# Altium schematic sheet SOM_JB2.SchDoc: SoM TE0720 JB2
size 420 x 297 mm; Author: P. Zdunek; DrawnBy: P. Zdunek; Organization: Altium Limited; Address1: L3, 12a Rodborough Rd; Address2: Frenchs Forest; Address3: NSW; Address4: Australia 2086; DocumentNumber: 4; SheetNumber: 4; SheetTotal: 37; ModifiedBy: -; CheckedDate: -; Title2: Fast Stabilizer; DivGrp: WUT ISE; Designer: G.Kasprowicz
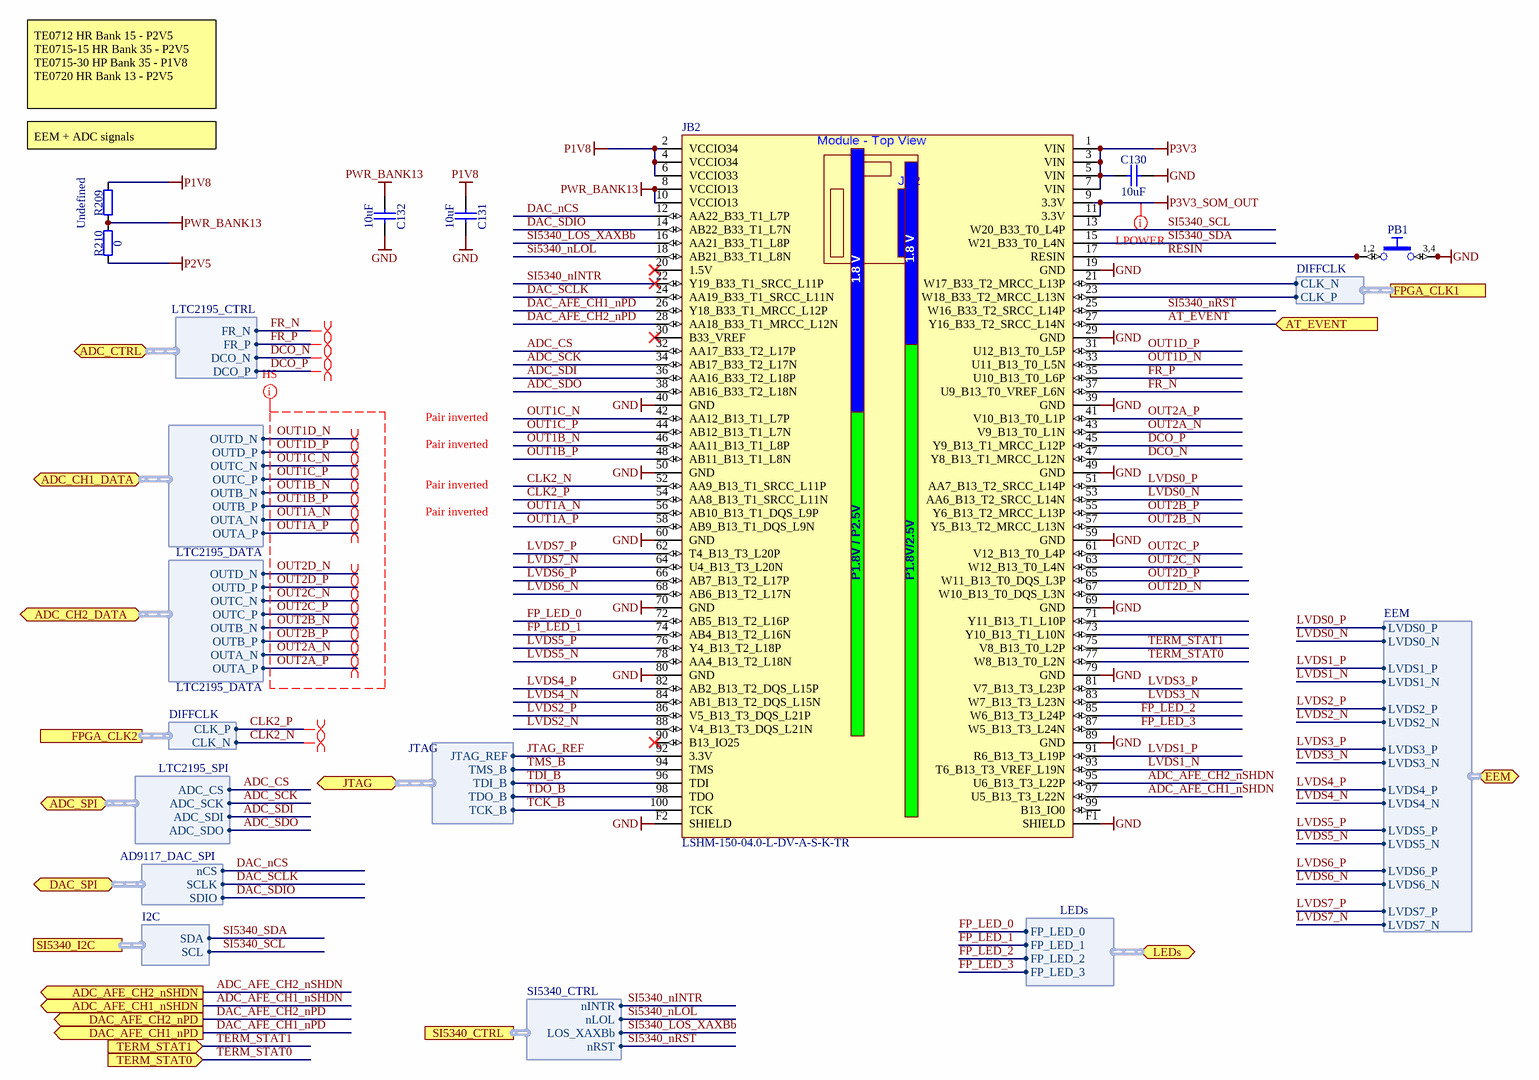
[diagram p0: SOM_JB2.SchDoc]

## Parts
C130  10uF  [CAPC1608X80N]
C131  10uF  [CAPC1608X80N]
C132  10uF  [CAPC1608X80N]
JB2  LSHM-150-04.0-L-DV-A-S-K-TR  [LSHM-150-XXX-X-DV-A-X]
PB1  Push Button  [PB_TYCO_FSM6JSMA]  (value not drawn)
R209  Undefined  [RESC1608X55N]
R210  0  [RESC1005X40N]

## Ports
ADC_AFE_CH1_nSHDN (out), ADC_AFE_CH2_nSHDN (out), ADC_CH1_DATA (bidir, harness LTC2195_DATA), ADC_CH2_DATA (bidir, harness LTC2195_DATA), ADC_CTRL (bidir, harness LTC2195_CTRL), ADC_SPI (bidir, harness LTC2195_SPI), AT_EVENT (in), DAC_AFE_CH1_nPD (out), DAC_AFE_CH2_nPD (out), DAC_SPI (bidir, harness AD9117_DAC_SPI), EEM (bidir, harness EEM), FPGA_CLK1 (harness DIFFCLK), FPGA_CLK2 (harness DIFFCLK), JTAG (bidir, harness JTAG), LEDs (bidir, harness LEDs), SI5340_CTRL (harness SI5340_CTRL), SI5340_I2C (harness I2C), TERM_STAT0 (in), TERM_STAT1 (in)

## Harnesses
JTAG: JTAG_REF, TDO_B, TMS_B, TDI_B, TCK_B
EEM: LVDS0_P, LVDS0_N, LVDS1_P, LVDS1_N, LVDS2_P, LVDS2_N, LVDS3_P, LVDS3_N, LVDS4_P, LVDS4_N, LVDS5_P, LVDS5_N, LVDS6_P, LVDS6_N, LVDS7_P, LVDS7_N
LTC2195_DATA: OUTD_N, OUTD_P, OUTC_N, OUTC_P, OUTB_N, OUTB_P, OUTA_N, OUTA_P
LTC2195_CTRL: FR_N, FR_P, DCO_N, DCO_P
DIFFCLK: CLK_P, CLK_N
LTC2195_SPI: ADC_CS, ADC_SCK, ADC_SDI, ADC_SDO
AD9117_DAC_SPI: SCLK, nCS, SDIO
I2C: SDA, SCL
SI5340_CTRL: nINTR, nLOL, LOS_XAXBb, nRST
LEDs: FP_LED_0, FP_LED_1, FP_LED_2, FP_LED_3

## Nets
GND: C130.2 C131.2 C132.2 JB2.19(GND) JB2.29(GND) JB2.39(GND) JB2.40(GND) JB2.49(GND) JB2.50(GND) JB2.59(GND) JB2.60(GND) JB2.69(GND) JB2.70(GND) JB2.79(GND) JB2.80(GND) JB2.89(GND) JB2.F1(SHIELD) JB2.F2(SHIELD) PB1.3 PB1.4
P1V8: C131.1 JB2.2(VCCIO34) JB2.4(VCCIO34) JB2.6(VCCIO33) R209.2
P2V5: R210.1
P3V3: C130.1 JB2.1(VIN) JB2.3(VIN) JB2.5(VIN) JB2.7(VIN)
P3V3_SOM_OUT: JB2.9(3.3V) JB2.11(3.3V)
PWR_BANK13: C132.1 JB2.8(VCCIO13) JB2.10(VCCIO13) R209.1 R210.2
ADC_AFE_CH1_nSHDN: JB2.97(U5_B13_T3_L22N) ; port ADC_AFE_CH1_nSHDN
ADC_AFE_CH2_nSHDN: JB2.95(U6_B13_T3_L22P) ; port ADC_AFE_CH2_nSHDN
ADC_CS: JB2.32(AA17_B33_T2_L17P) ; port ADC_SPI.ADC_CS
ADC_SCK: JB2.34(AB17_B33_T2_L17N) ; port ADC_SPI.ADC_SCK
ADC_SDI: JB2.36(AA16_B33_T2_L18P) ; port ADC_SPI.ADC_SDI
ADC_SDO: JB2.38(AB16_B33_T2_L18N) ; port ADC_SPI.ADC_SDO
AT_EVENT: JB2.27(Y16_B33_T2_SRCC_L14N) ; port AT_EVENT
CLK2_N: JB2.52(AA9_B13_T1_SRCC_L11P) ; port FPGA_CLK2.CLK_N
CLK2_P: JB2.54(AA8_B13_T1_SRCC_L11N) ; port FPGA_CLK2.CLK_P
DAC_AFE_CH1_nPD: JB2.26(Y18_B33_T1_MRCC_L12P) ; port DAC_AFE_CH1_nPD
DAC_AFE_CH2_nPD: JB2.28(AA18_B33_T1_MRCC_L12N) ; port DAC_AFE_CH2_nPD
DAC_nCS: JB2.12(AA22_B33_T1_L7P) ; port DAC_SPI.nCS
DAC_SCLK: JB2.24(AA19_B33_T1_SRCC_L11N) ; port DAC_SPI.SCLK
DAC_SDIO: JB2.14(AB22_B33_T1_L7N) ; port DAC_SPI.SDIO
DCO_N: JB2.47(Y8_B13_T1_MRCC_L12N) ; port ADC_CTRL.DCO_N
DCO_P: JB2.45(Y9_B13_T1_MRCC_L12P) ; port ADC_CTRL.DCO_P
FP_LED_0: JB2.72(AB5_B13_T2_L16P) ; port LEDs.FP_LED_0
FP_LED_1: JB2.74(AB4_B13_T2_L16N) ; port LEDs.FP_LED_1
FP_LED_2: JB2.85(W6_B13_T3_L24P) ; port LEDs.FP_LED_2
FP_LED_3: JB2.87(W5_B13_T3_L24N) ; port LEDs.FP_LED_3
FR_N: JB2.37(U9_B13_T0_VREF_L6N) ; port ADC_CTRL.FR_N
FR_P: JB2.35(U10_B13_T0_L6P) ; port ADC_CTRL.FR_P
JTAG_REF: JB2.92(3.3V) ; port JTAG.JTAG_REF
LVDS0_N: JB2.53(AA6_B13_T2_SRCC_L14N) ; port EEM.LVDS0_N
LVDS0_P: JB2.51(AA7_B13_T2_SRCC_L14P) ; port EEM.LVDS0_P
LVDS1_N: JB2.93(T6_B13_T3_VREF_L19N) ; port EEM.LVDS1_N
LVDS1_P: JB2.91(R6_B13_T3_L19P) ; port EEM.LVDS1_P
LVDS2_N: JB2.88(V4_B13_T3_DQS_L21N) ; port EEM.LVDS2_N
LVDS2_P: JB2.86(V5_B13_T3_DQS_L21P) ; port EEM.LVDS2_P
LVDS3_N: JB2.83(W7_B13_T3_L23N) ; port EEM.LVDS3_N
LVDS3_P: JB2.81(V7_B13_T3_L23P) ; port EEM.LVDS3_P
LVDS4_N: JB2.84(AB1_B13_T2_DQS_L15N) ; port EEM.LVDS4_N
LVDS4_P: JB2.82(AB2_B13_T2_DQS_L15P) ; port EEM.LVDS4_P
LVDS5_N: JB2.78(AA4_B13_T2_L18N) ; port EEM.LVDS5_N
LVDS5_P: JB2.76(Y4_B13_T2_L18P) ; port EEM.LVDS5_P
LVDS6_N: JB2.68(AB6_B13_T2_L17N) ; port EEM.LVDS6_N
LVDS6_P: JB2.66(AB7_B13_T2_L17P) ; port EEM.LVDS6_P
LVDS7_N: JB2.64(U4_B13_T3_L20N) ; port EEM.LVDS7_N
LVDS7_P: JB2.62(T4_B13_T3_L20P) ; port EEM.LVDS7_P
OUT1A_N: JB2.56(AB10_B13_T1_DQS_L9P) ; port ADC_CH1_DATA.OUTA_N
OUT1A_P: JB2.58(AB9_B13_T1_DQS_L9N) ; port ADC_CH1_DATA.OUTA_P
OUT1B_N: JB2.46(AA11_B13_T1_L8P) ; port ADC_CH1_DATA.OUTB_N
OUT1B_P: JB2.48(AB11_B13_T1_L8N) ; port ADC_CH1_DATA.OUTB_P
OUT1C_N: JB2.42(AA12_B13_T1_L7P) ; port ADC_CH1_DATA.OUTC_N
OUT1C_P: JB2.44(AB12_B13_T1_L7N) ; port ADC_CH1_DATA.OUTC_P
OUT1D_N: JB2.33(U11_B13_T0_L5N) ; port ADC_CH1_DATA.OUTD_N
OUT1D_P: JB2.31(U12_B13_T0_L5P) ; port ADC_CH1_DATA.OUTD_P
OUT2A_N: JB2.43(V9_B13_T0_L1N) ; port ADC_CH2_DATA.OUTA_N
OUT2A_P: JB2.41(V10_B13_T0_L1P) ; port ADC_CH2_DATA.OUTA_P
OUT2B_N: JB2.57(Y5_B13_T2_MRCC_L13N) ; port ADC_CH2_DATA.OUTB_N
OUT2B_P: JB2.55(Y6_B13_T2_MRCC_L13P) ; port ADC_CH2_DATA.OUTB_P
OUT2C_N: JB2.63(W12_B13_T0_L4N) ; port ADC_CH2_DATA.OUTC_N
OUT2C_P: JB2.61(V12_B13_T0_L4P) ; port ADC_CH2_DATA.OUTC_P
OUT2D_N: JB2.67(W10_B13_T0_DQS_L3N) ; port ADC_CH2_DATA.OUTD_N
OUT2D_P: JB2.65(W11_B13_T0_DQS_L3P) ; port ADC_CH2_DATA.OUTD_P
RESIN: JB2.17(RESIN) PB1.1 PB1.2
SI5340_LOS_XAXBb: JB2.16(AA21_B33_T1_L8P) ; port SI5340_CTRL.LOS_XAXBb
SI5340_nINTR: JB2.22(Y19_B33_T1_SRCC_L11P) ; port SI5340_CTRL.nINTR
Si5340_nLOL: JB2.18(AB21_B33_T1_L8N) ; port SI5340_CTRL.nLOL
SI5340_nRST: JB2.25(W16_B33_T2_SRCC_L14P) ; port SI5340_CTRL.nRST
SI5340_SCL: JB2.13(W20_B33_T0_L4P) ; port SI5340_I2C.SCL
SI5340_SDA: JB2.15(W21_B33_T0_L4N) ; port SI5340_I2C.SDA
TCK_B: JB2.100(TCK) ; port JTAG.TCK_B
TDI_B: JB2.96(TDI) ; port JTAG.TDI_B
TDO_B: JB2.98(TDO) ; port JTAG.TDO_B
TERM_STAT0: JB2.77(W8_B13_T0_L2N) ; port TERM_STAT0
TERM_STAT1: JB2.75(V8_B13_T0_L2P) ; port TERM_STAT1
TMS_B: JB2.94(TMS) ; port JTAG.TMS_B
NetJB2_21: JB2.21(W17_B33_T2_MRCC_L13P) ; port FPGA_CLK1.CLK_N
NetJB2_23: JB2.23(W18_B33_T2_MRCC_L13N) ; port FPGA_CLK1.CLK_P

Not connected (* = marked no-connect by the designer): JB2 20(1.5V)* 30(B33_VREF)* 71(Y11_B13_T1_L10P) 73(Y10_B13_T1_L10N) 90(B13_IO25)* 99(B13_IO0)

## Layout directives
differential pair: CLK2_N, CLK2_P, DCO_N, DCO_P, FR_N, FR_P, OUT1A_N, OUT1A_P, OUT1B_N, OUT1B_P, OUT1C_N, OUT1C_P, OUT1D_N, OUT1D_P, OUT2A_N, OUT2A_P, OUT2B_N, OUT2B_P, OUT2C_N, OUT2C_P, OUT2D_N, OUT2D_P
net class HIGH_SPEED: OUT1A_N, OUT1A_P, OUT1B_N, OUT1B_P, OUT1C_N, OUT1C_P, OUT1D_N, OUT1D_P, OUT2A_N, OUT2A_P, OUT2B_N, OUT2B_P, OUT2C_N, OUT2C_P, OUT2D_N, OUT2D_P
net class Lpower: P3V3_SOM_OUT

## Notes on the sheet
- TE0712 HR Bank 15 - P2V5
  TE0715-15 HR Bank 35 - P2V5
  TE0715-30 HP Bank 35 - P1V8
  TE0720 HR Bank 13 - P2V5
- (near R209) EEM + ADC signals
- (near JB2) 1.8 V
- Pair inverted
- (near JB2) P1.8V / P2.5V
- (near JB2) P1.8V/2.5V
- Project/Equipment
- Document
- Designer
- Drawn by
- Check.by
- Copyright WUT ISE 2020.
  This documentation describes Open Hardware and is licensed under the CERN OHL v.1.2. You may redistribute and modify this documentation under the terms of the CERN OHL v.1.2. (http://ohwr.org/CERNOHL). This documentation is distributed WITHOUT ANY EXPRESS OR IMPLIED WARRANTY, INCLUDING OF MERCHANTABILITY, SATISFACTORY QUALITY AND FITNESS FOR A PARTICULAR PURPOSE. Please see the CERN OHL v.1.2 for applicable conditions.
- Contact
- File
- Last Mod.
- Print Date
- Sheet
- Size
- A3
- of
- Rev
- (in symbol 25286) Module - Top View
- (in symbol PB_TYCO_FSM6JSMA) 1,2; 3,4

## Library data of the parts
C130-C132 = CC0603_10UF_10V_10%_X5R: Non-polarised capacitor; Part Description: SMD Multilayer Chip Ceramic Capacitor; Manufacturer: GENERIC; Manufacturer1 Part Number: GRM188R61A106KE69D; Voltage: 10V; TC: X5R; Tolerance: ±10%; Part Number: CC0603_10UF_10V_10%_X5R; Component Kind: Standard; Component Type: Standard; Pin Count: 2; Value: 10uF; Status: None; Manufacturer Part Number: CC0603_10UF_10V_10%_X5R; Case: 0603; Mounted: Yes; Socket: No; SMD: Yes; Sense: No; Manufacturer1 Example: MURATA; Manufacturer1 ComponentHeight: 0.8mm; HelpURL: \\cern.ch\dfs\Applications\Altium\Datasheets\CC0603_MURATA_GRM188R61A106KE69D.pdf; Author: CERN DEM JLC; CreateDate: 31/01/2017; LatestRevisionDate: 31/01/2017
JB2 = 25286: Samtec Razor Beam REF-189017-02, LF-04.0, 60 Pins, für alle 4x5 SoMs; Mixed: SMT; Trenz-Stock: Yes; Trenz-Article-Number: 23838; AN: 25286; Part Number: LSHM-150-04.0-L-DV-A-S-K-TR
PB1 = PB_TYCO_FSM6JSMA: Push-Button Switch SPDT; Part Description: 12VDC 50mA SPST Tactile  Push-Button Switch; Manufacturer: TYCO ELECTRONICS; Manufacturer Part Number: FSM6JSMA or  4-1437565-9; PressFit: No; Part Number: PB_TYCO_FSM6JSMA; Component Kind: Standard; Component Type: Standard; Pin Count: 4; PackageDescription: Body 6mm x 6mm, Surface Mount Tactile Switches, TYCO ALCOSWITCH FSMJSMA Series; Family: Push Button; Mounted: Yes; Socket: No; SMD: Yes; Sense: No; Status: None; ComponentHeight: 7.11mm; HelpURL: \\cern.ch\dfs\Applications\Altium\Datasheets\PB_TYCO_FSM6JSMA.pdf; Author: CERN DEM JLC; CreateDate: 21-Jun-12; LatestRevisionDate: 21-Jun-12
R209 = R0603_NO-VALUE: Resistor; Part Description: Reserved Footprint For a 0603 (1608) Chip Resistor; PressFit: No; Mounted: No; Part Number: R0603_NO-VALUE; Component Kind: Standard; Component Type: Standard; Pin Count: 2; Value: Undefined; Status: None; Manufacturer: Undefined; Manufacturer Part Number: R0603_NO-VALUE; Case: 0603; Sense: No; Socket: No; SMD: Yes; Manufacturer1 Example: Undefined; Manufacturer1 Part Number: Undefined; Manufacturer1 ComponentHeight: Undefined; HelpURL: Undefined; Author: CERN DEM JLC; CreateDate: 03.12.2007; LatestRevisionDate: 13.03.2008
R210 = R0402_0R_JUMPER: Resistor; Part Description: 1A (0.05R Max DC Resistance) Zero Ohm Jumper; Manufacturer: GENERIC; Manufacturer1 Part Number: 232270591001L; PressFit: No; Part Number: R0402_0R_JUMPER; Component Kind: Standard; Component Type: Standard; Pin Count: 2; Value: 0; Status: Not Recommended; Manufacturer Part Number: R0402_0R_JUMPER; Case: 0402; Mounted: Yes; Sense: No; Socket: No; SMD: Yes; Manufacturer1 Example: YAGEO PHYCOMP; Manufacturer1 ComponentHeight: 0.4mm; HelpURL: \\cern.ch\dfs\Applications\Altium\Datasheets\R0402_Phycomp_RC0402.pdf; Author: CERN DEM JLC; CreateDate: 03.12.2007; LatestRevisionDate: 17.10.2012